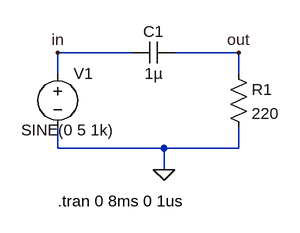
[diagram p0: schematic ckt1.asc]
ckt1.asc, the LTspice schematic file:
Version 4
SHEET 1 880 680
WIRE 192 16 80 16
WIRE 352 16 256 16
WIRE 80 48 80 16
WIRE 352 48 352 16
WIRE 80 160 80 128
WIRE 240 160 80 160
WIRE 352 160 352 128
WIRE 352 160 240 160
WIRE 240 192 240 160
FLAG 240 192 0
FLAG 80 16 in
FLAG 352 16 out
SYMBOL voltage 80 32 R0
WINDOW 3 -55 101 Left 2
WINDOW 123 0 0 Left 0
WINDOW 39 0 0 Left 0
SYMATTR InstName V1
SYMATTR Value SINE(0 5 1k)
SYMBOL cap 256 0 R90
WINDOW 0 0 32 VBottom 2
WINDOW 3 32 32 VTop 2
SYMATTR InstName C1
SYMATTR Value 1µ
SYMBOL res 336 32 R0
SYMATTR InstName R1
SYMATTR Value 220
TEXT 80 240 Left 2 !.tran 0 8ms 0 1us

The netlist it stands for:
* ckt1.asc
V1 in 0 SINE(0 5 1k)
C1 out in 1µ
R1 out 0 220
.tran 0 8ms 0 1us
.backanno
.end

* Results of the author's LTspice run, read from the files saved beside the schematic
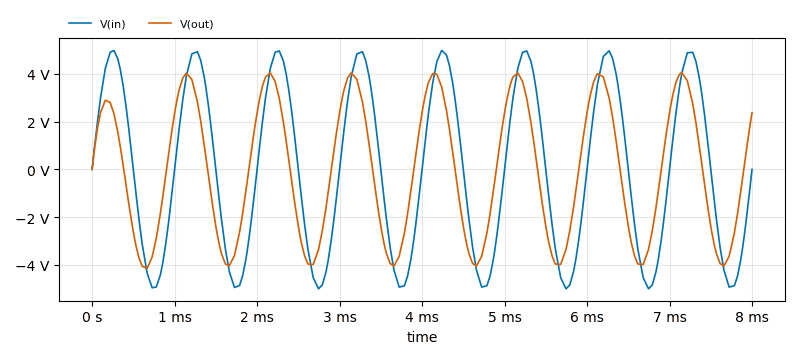
[diagram p1: Transient Analysis of ckt1.asc, plotted from the saved traces]
* Transient Analysis, 1 run:
*   V(in): min -4.998 V, max 4.985 V, average 94.43 µV, rms 3.518 V, last 0 V
*   V(out): min -4.14 V, max 4.051 V, average -65.33 mV, rms 2.81 V, last 2.374 V